# EAGLE design NanoBud (EAGLE 8.2.2)
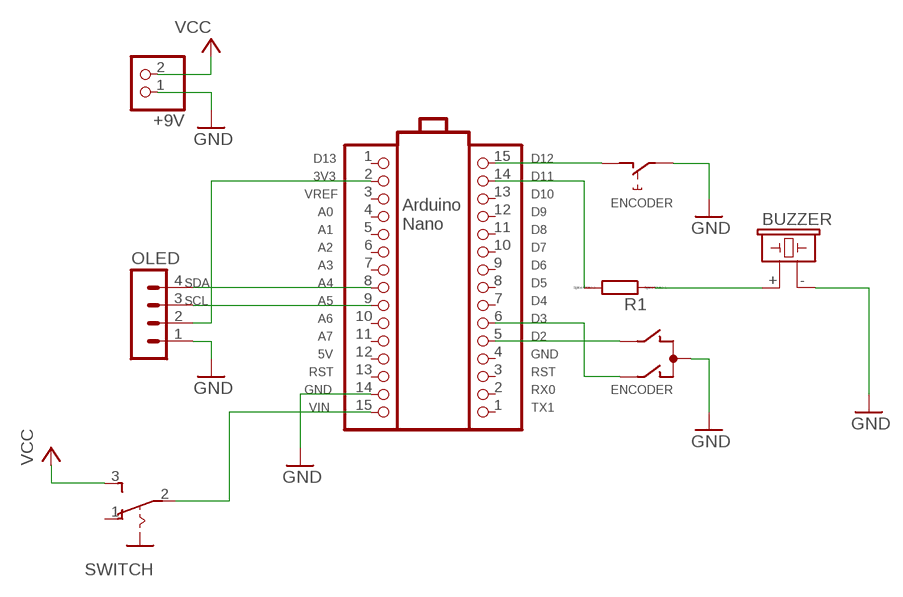
[diagram p0: schematic, sheet 1]

## Parts
+9V  PINHD-1X2  [1X02]
BUZZER  F/CM12P  [F/CM12P]
ENCODER  EC12E_SW  [ALPS_EC12E_SW]
OLED  MA04-1  [MA04-1]
R1  R0204/7  [0204/7]
SV1  PINHD-1X15  [1X15]
SV2  PINHD-1X15  [1X15]
SWITCH  M251  [M251]

## Nets
GND: +9V.1 BUZZER.- ENCODER.C ENCODER.E OLED.1 SV2.14
N$1: ENCODER.A SV1.6
N$2: ENCODER.D SV1.15
N$4: ENCODER.B SV1.5
N$5: OLED.2 SV2.2
N$6: OLED.3 SV2.9
N$7: OLED.4 SV2.8
N$8: BUZZER.+ R1.1
N$9: R1.2 SV1.14
N$10: SV2.15 SWITCH.2(P)
VCC: +9V.2 SWITCH.3(S)
Unconnected: ENCODER.GND1(G) ENCODER.GND2(G) SV1.1 SV1.2 SV1.3 SV1.4 SV1.7 SV1.8 SV1.9 SV1.10 SV1.11 SV1.12 SV1.13 SV2.1 SV2.3 SV2.4 SV2.5 SV2.6 SV2.7 SV2.10 SV2.11 SV2.12 SV2.13 SWITCH.1(O)

## Notes on the sheet
- D13 | D12
- 3V3 | D11
- VREF | D10
- A0 | D9
- Arduino
  Nano
- A1 | D8
- A2 | D7
- A3 | D6
- SDA | A4 | D5
- SCL | A5 | D4
- A6 | D3
- A7 | D2
- 5V | GND
- RST | RST
- GND | RX0
- VIN | TX1

## Library data of the parts
+9V = pinhead:PINHD-1X2: PIN HEADER
BUZZER = buzzer:F/CM12P: BUZZER Source: Buerklin; OC_FARNELL: unknown; OC_NEWARK: unknown
ENCODER = switch-alps:EC12E_SW: ALPS rotary Encoder EC12E series with switch; MPN: EC12E2424407; OC_FARNELL: 1520813; OC_NEWARK: 74M1068
OLED = con-lstb:MA04-1: PIN HEADER; OC_FARNELL: unknown; OC_NEWARK: unknown
R1 = eagle-ltspice:R: RESISTOR, European symbol; SPICEMODEL: NONE; SPICEPREFIX: R
SV1 SV2 = pinhead:PINHD-1X15: PIN HEADER
SWITCH = switch:M251: SLIDING SWITCH Mors, distributor Buerklin, 11G702

## Board
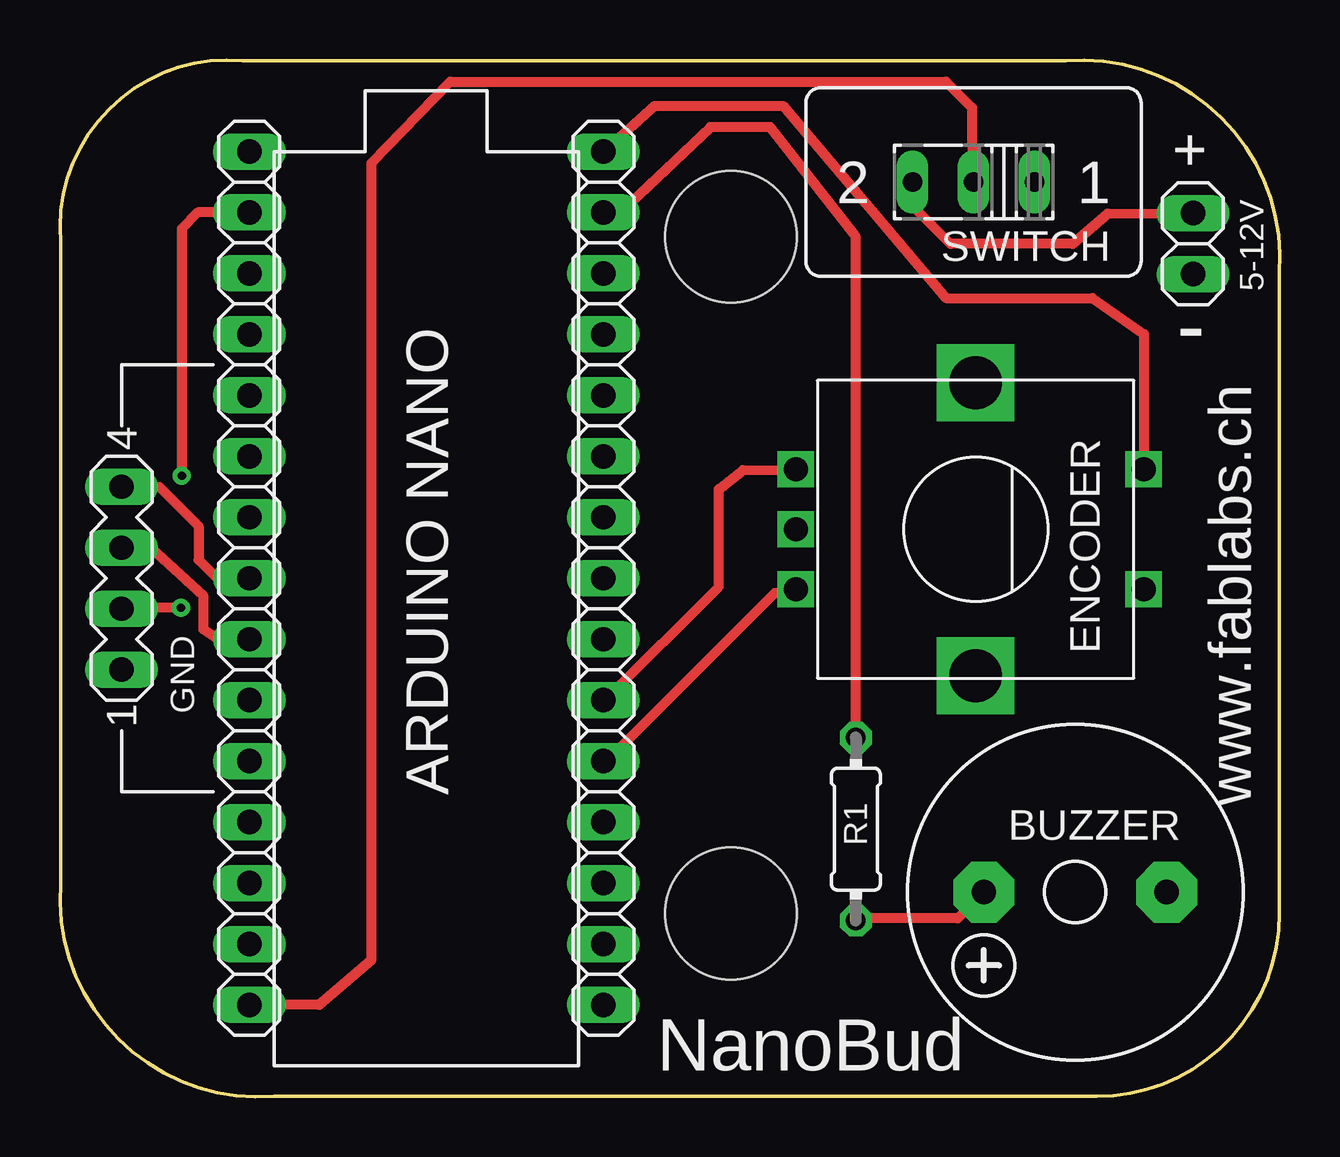
[diagram p1: board, top side]
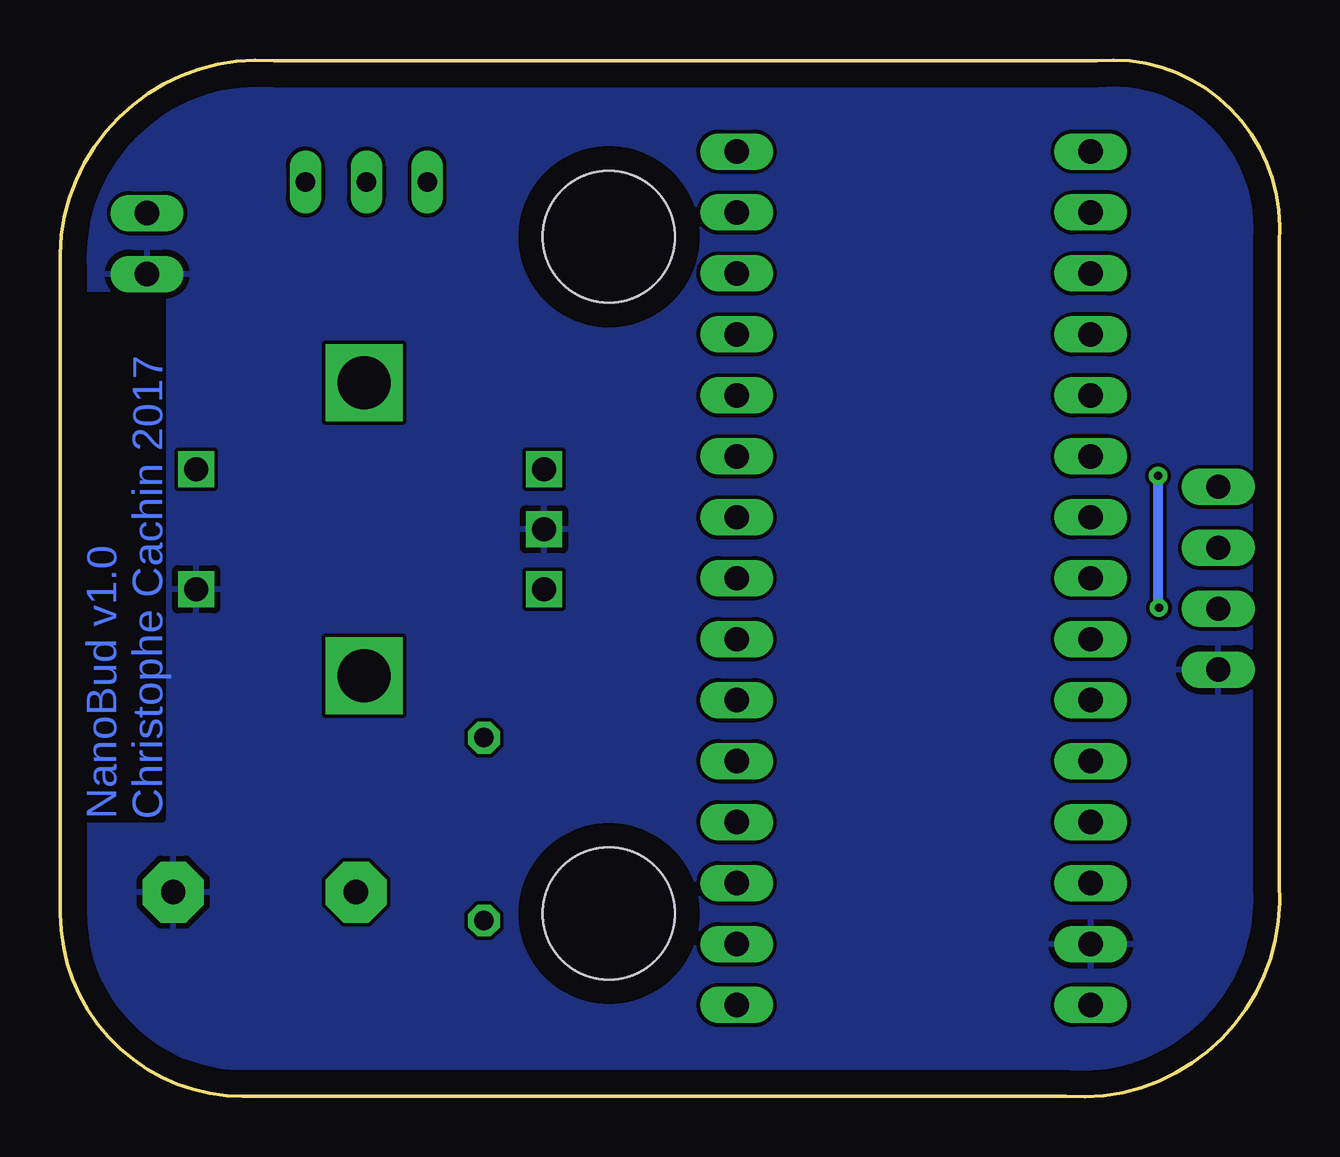
[diagram p2: board, bottom side, seen from below]

Size 50.85 x 43.21 mm. Coordinates in mm from the lower left corner, seen from the top.
Outline: 7.62,43.18 arc100 0.03,35.58 0.03,8.88
Outline: 50.83,7.64 arc-90 43.21,0.02
Outline: 41.91,43.18 arc-99 50.83,34.31
Outline: 8.92,0.02 arc-99 0.03,8.91
Outline: 8.93,0.03 29.18,0.03 29.7,0.03 43.23,0.03
Outline: 50.83,34.33 50.83,7.63
Outline: 7.63,43.18 41.93,43.18
Copper layers (1*16): Top 0.035mm / dielectric 1.5mm / Bottom 0.035mm
Design rules "default": minimum track width 6mil, minimum drill 0.35mm, track to track 6mil, track to pad 6mil, pad to pad 6mil, via to via 6mil, smd to smd 6mil, copper to edge 40mil, drill to drill 6mil, minimum pad ring 10mil, minimum via ring 8mil, stop-mask expansion 4mil, vias tented up to drill 0mil, thermal gap 10mil
Holes 5.5 mm at 27.97,7.64 27.97,35.84

### Footprints (pad centres in the part's own frame; a part is rotated, then mirrored left to right if it is on the bottom)
1X02 = drill 1.016 long: 1 -1.27,0; 2 1.27,0
F/CM12P = drill 1.016 pad 2.54 octagon: + 3.81,0; - -3.81,0
ALPS_EC12E_SW = drill 1 square: A -2.5,-7.5; B 2.5,-7.5; C 0,-7.5; D -2.5,7; E 2.5,7 | drill 2.2 square: GND1 -6.1,0; GND2 6.1,0
MA04-1 = drill 1.016 long: 1 -3.81,0; 2 -1.27,0; 3 1.27,0; 4 3.81,0
0204/7 = drill 0.813 octagon: 1 -3.81,0; 2 3.81,0
1X15 = drill 1.016 long: 1 -17.78,0; 2 -15.24,0; 3 -12.7,0; 4 -10.16,0; 5 -7.62,0; 6 -5.08,0; 7 -2.54,0; 8 0,0; 9 2.54,0; 10 5.08,0; 11 7.62,0; 12 10.16,0; 13 12.7,0; 14 15.24,0; 15 17.78,0
M251 = drill 0.813 long: 1 -2.54,0; 2 0,0; 3 2.54,0

### Placement (x,y rotation side)
+9V  47.22,35.56 90 top
BUZZER  42.32,8.53 180 top
ENCODER  38.17,23.65 270 top
OLED  2.57,21.61 90 top
R1  33.18,11.16 90 top
SV1  22.65,21.61 90 top
SV2  7.89,21.61 270 top
SWITCH  38.08,38.12 180 top

### Tracks (layer width: path | path; a pad name or v marks a point on that pad's centre or on a via)
GND
  pour Bottom: 6.68,42.58 arc90 0.68,36.58 0.68,8.58 arc90 8.18,1.08 43.18,1.08 arc90 50.18,8.08 50.18,8.58 arc-90 50.18,9.08 arc90 50.18,9.58 50.18,35.08 arc90 42.68,42.58
N$1
  Top 0.152: 22.79,16.58 SV1.6
  Top 0.406: 22.79,16.58 27.46,21.26 27.46,25.33 28.46,26.12 30.56,26.13 ENCODER.A
N$2
  Top 0.406: ENCODER.D 45.18,31.78 43.04,33.28 36.94,33.29 30.14,41.29 24.79,41.29 SV1.15
N$4
  Top 0.152: 22.79,13.99 SV1.5
  Top 0.406: 22.79,13.99 29.8,21 30.56,21 ENCODER.B
N$5  (via drill 0.35)
  Top 0.406: SV2.2 5.75,36.85 5.08,36.18 v5.08,25.88 | v5.04,20.38 2.61,20.38 OLED.2
  Bottom 0.406: v5.08,25.88 5.08,20.38 v5.04,20.38
N$6
  Top 0.406: OLED.3 3.78,22.88 5.98,20.88 5.98,19.48 6.58,19.08 SV2.9
N$7
  Top 0.406: OLED.4 4.14,25.42 5.78,23.78 5.78,22.38 6.58,21.58 7.86,21.58 SV2.8
N$8
  Top 0.152: 33.3,7.44 R1.1
  Top 0.406: 33.3,7.44 37.42,7.44 BUZZER.+
N$9
  Top 0.152: 33.15,15.06 R1.2
  Top 0.406: 33.15,15.06 33.15,35.87 29.61,40.41 27.11,40.41 23.38,36.88 SV1.14
N$10
  Top 0.152: 38.03,38.22 SWITCH.2
  Top 0.406: 38.03,38.22 38.02,41.22 36.93,42.31 16.27,42.31 12.98,38.92 12.98,5.71 10.8,3.83 SV2.15
VCC
  Top 0.152: 35.59,38.07 SWITCH.3
  Top 0.406: 35.59,38.07 35.6,37.07 37.12,35.55 42.22,35.55 43.67,36.8 +9V.2

### Text on the board
Bottom: NanoBud v1.0 / Christophe Cachin 2017
tPlace: + | - | GND
tNames: 5-12V | www.fablabs.ch | ARDUINO NANO | NanoBud